# Altium schematic sheet MCU.SchDoc: Bison-Board
size A4; DrawnBy: mzy2364; Revision: V1.4
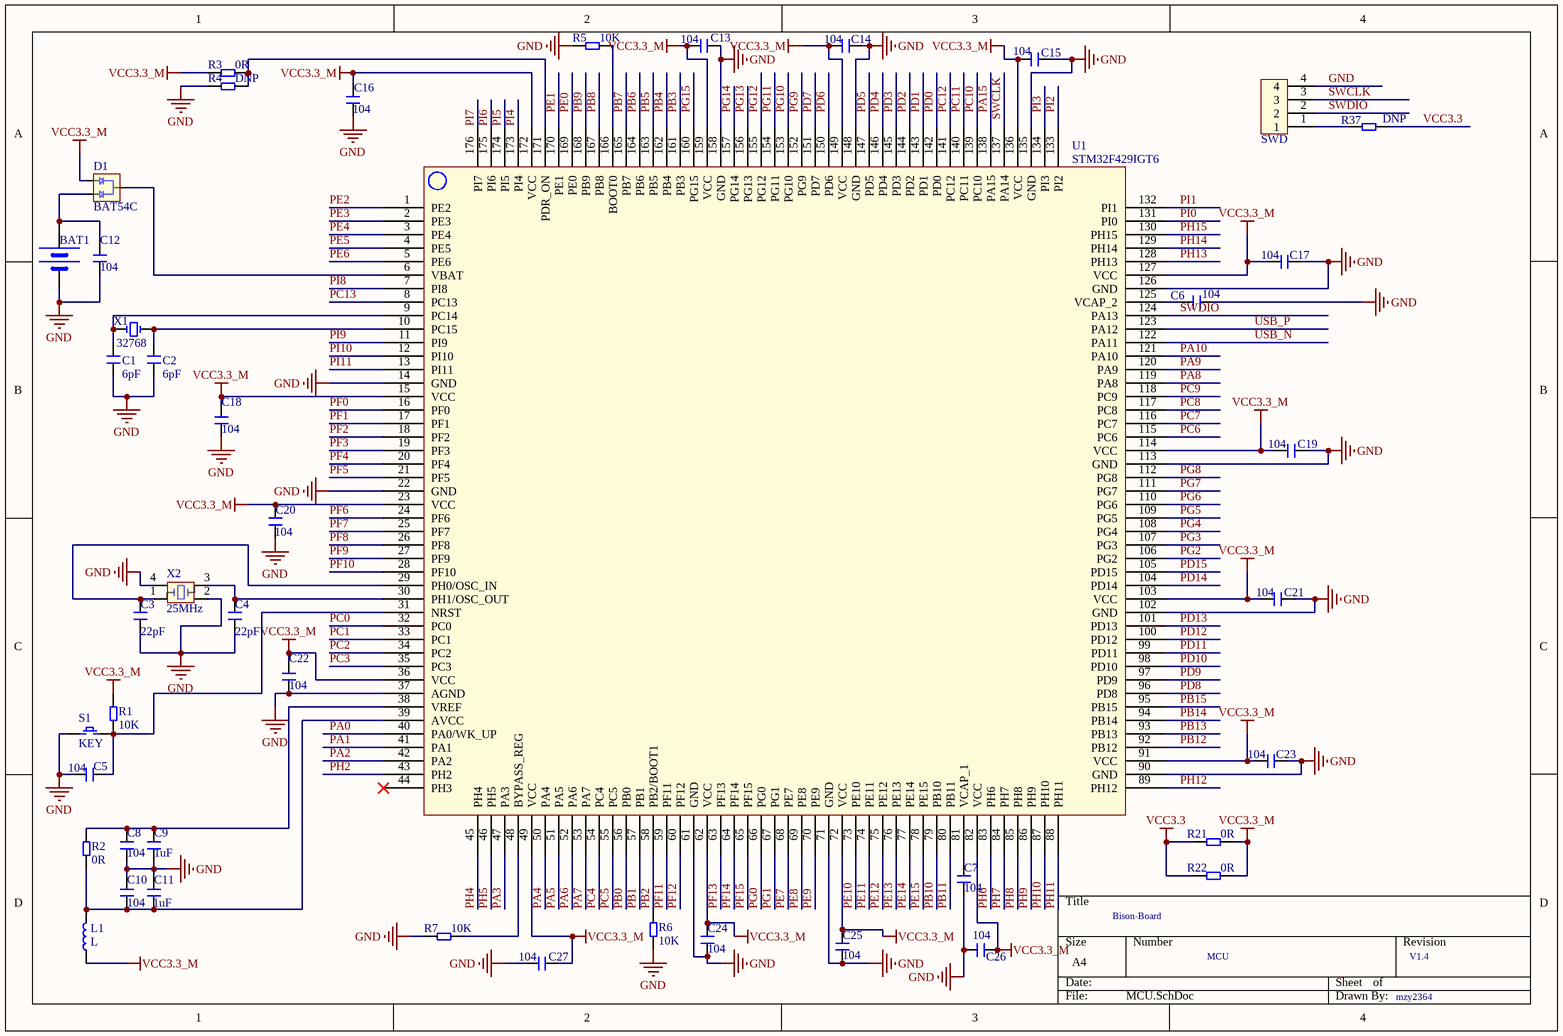
[diagram p0: MCU.SchDoc]

## Parts
BAT1  BATTERY  [SBAT-1220]  (value not drawn)
C1  6pF  [C 0603]
C2  6pF  [C 0603]
C3  22pF  [C 0603]
C4  22pF  [C 0603]
C5  104  [C 0603]
C6  104  [C 0603]
C7  104  [C 0603]
C8  104  [C 0603]
C9  1uF  [C 0603]
C10  104  [C 0603]
C11  1uF  [C 0603]
C12  104  [C 0603]
C13  104  [C 0603]
C14  104  [C 0603]
C15  104  [C 0603]
C16  104  [C 0603]
C17  104  [C 0603]
C18  104  [C 0603]
C19  104  [C 0603]
C20  104  [C 0603]
C21  104  [C 0603]
C22  104  [C 0603]
C23  104  [C 0603]
C24  104  [C 0603]
C25  104  [C 0603]
C26  104  [C 0603]
C27  104  [C 0603]
D1  BAT54C  [SOT23-3]
L1  L  [L 0603]
R1  10K  [R 0603]
R2  0R  [R 0603]
R3  0R  [R 0603]
R4  DNP  [R 0603]
R5  10K  [R 0603]
R6  10K  [R 0603]
R7  10K  [R 0603]
R21  0R  [R 0603]
R22  0R  [R 0603]
R37  DNP  [R 0603]
S1  KEY  [KEY SMD-3*6*2.5]
SWD  Header 4  [XH2.54-LS-4P]  (value not drawn)
U1  STM32F429IGT6  [STM32F429IG]
X1  32768  [XTAL-3215]
X2  25MHz  [XTAL-3225]

## Nets
GND: BAT1.2(GND) C1.1 C2.1 C3.1 C4.1 C5.2 C6.2 C7.1 C8.1 C9.1 C10.2 C11.2 C12.2 C13.1 C14.1 C15.1 C16.2 C17.1 C18.1 C19.1 C20.1 C21.1 C22.1 C23.1 C24.1 C25.1 C26.2 C27.2 R4.2 R5.2 R6.1 R7.2 S1.1 SWD.4 U1.14(GND) U1.22(GND) U1.37(AGND) U1.61(GND) U1.71(GND) U1.90(GND) U1.102(GND) U1.113(GND) U1.126(GND) U1.135(GND) U1.148(GND) U1.158(GND) X2.2 X2.4
VCC3.3: R21.1 R22.1 R37.2
VCC3.3_M: C13.2 C14.2 C15.2 C16.1 C17.2 C18.2 C19.2 C20.2 C21.2 C22.2 C23.2 C24.2 C25.2 C26.1 C27.1 D1.1 L1.2 R1.2 R3.2 R21.2 R22.2 U1.15(VCC) U1.23(VCC) U1.36(VCC) U1.49(VCC) U1.62(VCC) U1.72(VCC) U1.82(VCC) U1.91(VCC) U1.103(VCC) U1.114(VCC) U1.127(VCC) U1.136(VCC) U1.149(VCC) U1.159(VCC) U1.172(VCC)
PA0: U1.40(PA0/WK_UP)
PA1: U1.41(PA1)
PA2: U1.42(PA2)
PA3: U1.47(PA3)
PA4: U1.50(PA4)
PA5: U1.51(PA5)
PA6: U1.52(PA6)
PA7: U1.53(PA7)
PA8: U1.119(PA8)
PA9: U1.120(PA9)
PA10: U1.121(PA10)
PA15: U1.138(PA15)
PB0: U1.56(PB0)
PB1: U1.57(PB1)
PB2: R6.2 U1.58(PB2/BOOT1)
PB3: U1.161(PB3)
PB4: U1.162(PB4)
PB5: U1.163(PB5)
PB6: U1.164(PB6)
PB7: U1.165(PB7)
PB8: U1.167(PB8)
PB9: U1.168(PB9)
PB10: U1.79(PB10)
PB11: U1.80(PB11)
PB12: U1.92(PB12)
PB13: U1.93(PB13)
PB14: U1.94(PB14)
PB15: U1.95(PB15)
PC0: U1.32(PC0)
PC1: U1.33(PC1)
PC2: U1.34(PC2)
PC3: U1.35(PC3)
PC4: U1.54(PC4)
PC5: U1.55(PC5)
PC6: U1.115(PC6)
PC7: U1.116(PC7)
PC8: U1.117(PC8)
PC9: U1.118(PC9)
PC10: U1.139(PC10)
PC11: U1.140(PC11)
PC12: U1.141(PC12)
PC13: U1.8(PC13)
PD0: U1.142(PD0)
PD1: U1.143(PD1)
PD2: U1.144(PD2)
PD3: U1.145(PD3)
PD4: U1.146(PD4)
PD5: U1.147(PD5)
PD6: U1.150(PD6)
PD7: U1.151(PD7)
PD8: U1.96(PD8)
PD9: U1.97(PD9)
PD10: U1.98(PD10)
PD11: U1.99(PD11)
PD12: U1.100(PD12)
PD13: U1.101(PD13)
PD14: U1.104(PD14)
PD15: U1.105(PD15)
PE0: U1.169(PE0)
PE1: U1.170(PE1)
PE2: U1.1(PE2)
PE3: U1.2(PE3)
PE4: U1.3(PE4)
PE5: U1.4(PE5)
PE6: U1.5(PE6)
PE7: U1.68(PE7)
PE8: U1.69(PE8)
PE9: U1.70(PE9)
PE10: U1.73(PE10)
PE11: U1.74(PE11)
PE12: U1.75(PE12)
PE13: U1.76(PE13)
PE14: U1.77(PE14)
PE15: U1.78(PE15)
PF0: U1.16(PF0)
PF1: U1.17(PF1)
PF2: U1.18(PF2)
PF3: U1.19(PF3)
PF4: U1.20(PF4)
PF5: U1.21(PF5)
PF6: U1.24(PF6)
PF7: U1.25(PF7)
PF8: U1.26(PF8)
PF9: U1.27(PF9)
PF10: U1.28(PF10)
PF11: U1.59(PF11)
PF12: U1.60(PF12)
PF13: U1.63(PF13)
PF14: U1.64(PF14)
PF15: U1.65(PF15)
PG0: U1.66(PG0)
PG1: U1.67(PG1)
PG2: U1.106(PG2)
PG3: U1.107(PG3)
PG4: U1.108(PG4)
PG5: U1.109(PG5)
PG6: U1.110(PG6)
PG7: U1.111(PG7)
PG8: U1.112(PG8)
PG9: U1.152(PG9)
PG10: U1.153(PG10)
PG11: U1.154(PG11)
PG12: U1.155(PG12)
PG13: U1.156(PG13)
PG14: U1.157(PG14)
PG15: U1.160(PG15)
PH2: U1.43(PH2)
PH4: U1.45(PH4)
PH5: U1.46(PH5)
PH6: U1.83(PH6)
PH7: U1.84(PH7)
PH8: U1.85(PH8)
PH9: U1.86(PH9)
PH10: U1.87(PH10)
PH11: U1.88(PH11)
PH12: U1.89(PH12)
PH13: U1.128(PH13)
PH14: U1.129(PH14)
PH15: U1.130(PH15)
PI0: U1.131(PI0)
PI1: U1.132(PI1)
PI2: U1.133(PI2)
PI3: U1.134(PI3)
PI4: U1.173(PI4)
PI5: U1.174(PI5)
PI6: U1.175(PI6)
PI7: U1.176(PI7)
PI8: U1.7(PI8)
PI9: U1.11(PI9)
PI10: U1.12(PI10)
PI11: U1.13(PI11)
SWCLK: SWD.3 U1.137(PA14)
SWDIO: SWD.2 U1.124(PA13)
USB_N: U1.122(PA11)
USB_P: U1.123(PA12)
NetBAT1_1: BAT1.1(VCC) C12.1 D1.2
NetC1_2: C1.2 U1.9(PC14) X1.1
NetC2_2: C2.2 U1.10(PC15) X1.2
NetC3_2: C3.2 U1.29(PH0/OSC_IN) X2.1
NetC4_2: C4.2 U1.30(PH1/OSC_OUT) X2.3
NetC5_1: C5.1 R1.1 S1.2 U1.31(NRST)
NetC6_1: C6.1 U1.125(VCAP_2)
NetC7_2: C7.2 U1.81(VCAP_1)
NetC8_2: C8.2 C9.2 R2.2 U1.38(VREF)
NetC10_1: C10.1 C11.1 L1.1 R2.1 U1.39(AVCC)
NetD1_3: D1.3 U1.6(VBAT)
NetR3_1: R3.1 R4.1 U1.171(PDR_ON)
NetR5_1: R5.1 U1.166(BOOT0)
NetR7_1: R7.1 U1.48(BYPASS_REG)
NetR37_1: R37.1 SWD.1

Not connected (* = marked no-connect by the designer): U1 44(PH3)*

## Notes on the sheet
- MCU

## Library data of the parts
C1-C27 = CAP
R1-R7 R21 R22 R37 = RES
X1 = XTAL-2P
X2 = XTAL-4P